# EAGLE schematic Teensy_v1.2 (EAGLE 7.7.0)
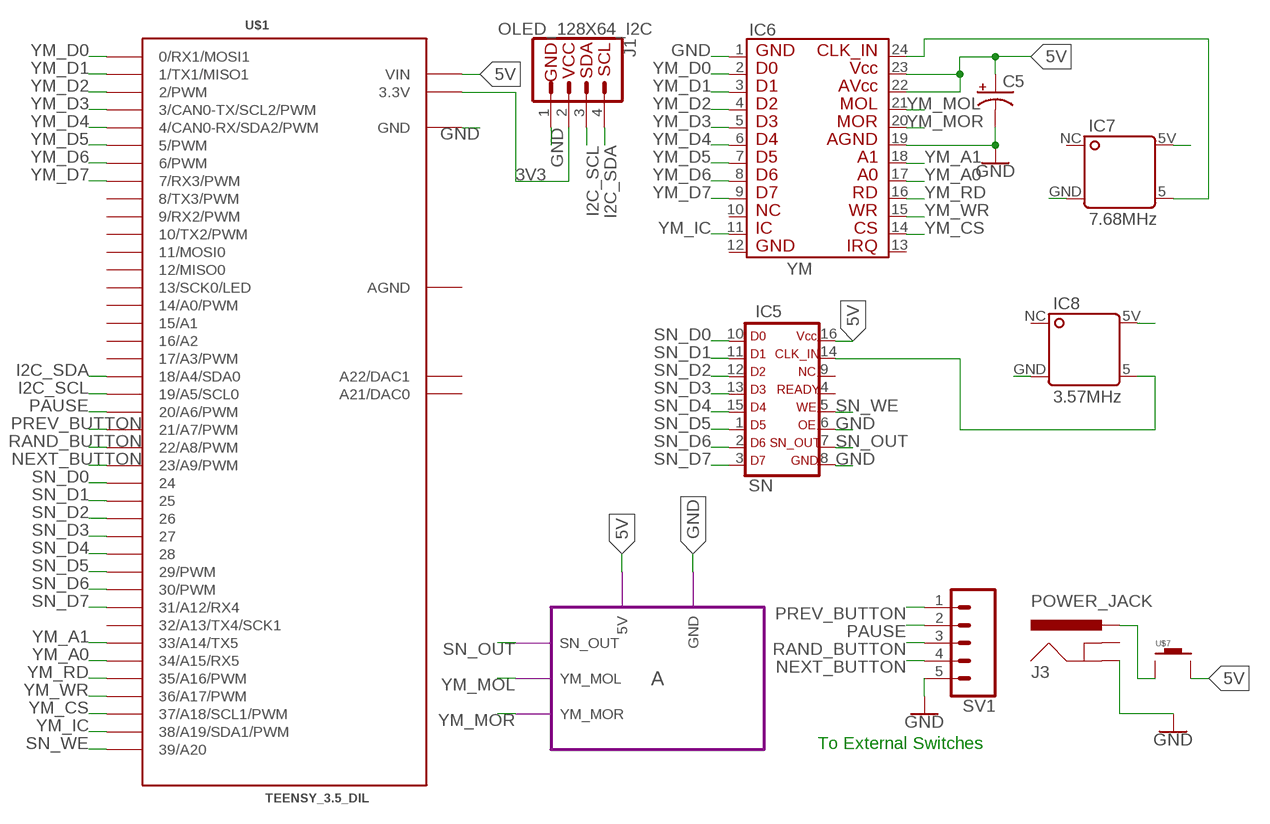
[diagram p0: schematic, sheet 1]

## Parts
C5  1000uF  CPOL-USE5-10.5  [E5-10,5]
IC5  SN  SN76489  [DIL16]
IC6  YM  YM2612-6  [DIL24-6]
IC7  7.68MHz  CLOCK_OSC  [DIL08-CLK]
IC8  3.57MHz  CLOCK_OSC  [DIL08-CLK]
J1  OLED_128X64_I2C  I2C_STANDARD  [1X04]
J3  POWER_JACK  [POWER_JACK_PTH]
SV1  CONN_05  [1X05]
U$1  TEENSY_3.5_DIL  [TEENSY_3.5_DIL]
U$7  GPTS20  [GPTS]

## Module instances
A = AMP

## Nets
3V3: J1.2 U$1.3.3V U$1.3.3V3(3.3V)
5V [power]: C5.+ IC5.16(V) IC6.22 IC6.23 IC7.5V IC8.5V U$1.VIN U$7.P$2 ; port A.5V
GND [power]: C5.- IC5.6(OE) IC5.8(GND) IC6.1 IC6.19 IC7.GND IC8.GND J1.1 J3.GND SV1.5 U$1.GND U$1.GND1(GND) ; port A.GND
I2C_SCL: J1.3 U$1.19/A5(19/A5/SCL0)
I2C_SDA: J1.4 U$1.18/A4(18/A4/SDA0)
N$1: IC6.24 IC7.5
N$2: J3.PWR U$7.P$1
N$11: IC5.14(CLK) IC8.5
NEXT_BUTTON: SV1.4 U$1.23/A9(23/A9/PWM)
PAUSE: SV1.2 U$1.20/A6(20/A6/PWM)
PREV_BUTTON: SV1.1 U$1.21/A7(21/A7/PWM)
RAND_BUTTON: SV1.3 U$1.22/A8(22/A8/PWM)
SN_D0: IC5.10(D0) U$1.24
SN_D1: IC5.11(D1) U$1.25
SN_D2: IC5.12(D2) U$1.26
SN_D3: IC5.13(D3) U$1.27
SN_D4: IC5.15(D4) U$1.28
SN_D5: IC5.1(D5) U$1.29(29/PWM)
SN_D6: IC5.2(D6) U$1.30(30/PWM)
SN_D7: IC5.3(D7) U$1.31/A12(31/A12/RX4)
SN_OUT: IC5.7(SN) ; port A.SN_OUT
SN_WE: IC5.5(WE) U$1.39/A20
YM_A0: IC6.17 U$1.34/A15(34/A15/RX5)
YM_A1: IC6.18 U$1.33/A14(33/A14/TX5)
YM_CS: IC6.14 U$1.37/A18(37/A18/SCL1/PWM)
YM_D0: IC6.2 U$1.0(0/RX1/MOSI1)
YM_D1: IC6.3 U$1.1(1/TX1/MISO1)
YM_D2: IC6.4 U$1.2(2/PWM)
YM_D3: IC6.5 U$1.3(3/CAN0-TX/SCL2/PWM)
YM_D4: IC6.6 U$1.4(4/CAN0-RX/SDA2/PWM)
YM_D5: IC6.7 U$1.5(5/PWM)
YM_D6: IC6.8 U$1.6(6/PWM)
YM_D7: IC6.9 U$1.7(7/RX3/PWM)
YM_IC: IC6.11 U$1.38/A19(38/A19/SDA1/PWM)
YM_MOL: IC6.21 ; port A.YM_MOL
YM_MOR: IC6.20 ; port A.YM_MOR
YM_RD: IC6.16 U$1.35/A16(35/A16/PWM)
YM_WR: IC6.15 U$1.36/A17(36/A17/PWM)
Unconnected: IC5.4(RDY) IC5.9(NC) IC6.10 IC6.12 IC6.13 IC7.NC IC8.NC J3.GNDBREAK U$1.8(8/TX3/PWM) U$1.9(9/RX2/PWM) U$1.10(10/TX2/PWM) U$1.11(11/MOSI0) U$1.12(12/MISO0) U$1.13(13/SCK0/LED) U$1.14/A0(14/A0/PWM) U$1.15/A1 U$1.16/A2 U$1.17/A3(17/A3/PWM) U$1.32/A13(32/A13/TX4/SCK1) U$1.A21(A21/DAC0) U$1.A22(A22/DAC1)

## Notes on the sheet
- To External Switches

## Power pins joined to a net without a drawn wire
AGND: U$1.AGND

## Library data of the parts
C5 = resistor:CPOL-US: POLARIZED CAPACITOR, American symbol; HEIGHT: 17.5
IC5 = Sega:SN76489: SN76489 Texas Instruments SN76489 PSG 16 DIP, Requires 3.57 MHz Clock 3 square wave tone generators. A wide range of frequencies. 16 different volume levels. 1 noise generator. 2 types (white noise and periodic). 3 different frequencies. 16 different volume levels. https://en.wikipedia.org/wiki/Texas_Instruments_SN76489; HEIGHT: 4.2
IC6 = Sega:YM2612: YM2612 Sound chip found in the Sega Genesis 24 DIP Package (OBN2); HEIGHT: 4.2
IC7 IC8 = Sega:CLOCK_OSC: CLOCK OSCILLATOR Dual In Line / Package; HEIGHT: 5.4
J1 = SparkFun-Connectors:I2C_STANDARD: SparkFun I2C Standard Pinout Header SparkFun has standardized on a pinout for all I2C based sensor breakouts. This pinout allows I2C boards to be plugged directly into the headers on Arduino Uno compatible boards, and to be daisy chained easily. Example SparkFun Products: SparkFun Atmospheric Sensor Breakout - BME280 <https://www.sparkfun.com/products/13676> SparkFun Altitude/Pressure Sensor Breakout - MPL3115A2 <https://www.sparkfun.com/products/11084> SparkFun TOF Range Finder Sensor - VL6180 <https://www.sparkfun.com/products/12785>
J3 = Sega:POWER_JACK: Power Jack Connector This is the standard 5.5mm barrel jack for power. The PTH is the most common, proven, reliable, footprint. The Slot footprint only works if the mill layer is transmitted to the PCB fab house so be warned. Here are the connectors we sell at SparkFun: DC Barrel Power Jack/Connector <https://www.sparkfun.com/products/119> (PRT-00119) DC Barrel Power Jack/Connector (SMD) <https://www.sparkfun.com/products/12748> (PRT-12748) DC Barrel Jack Adapter - Breadboard Compatible <https://www.sparkfun.com/products/10811> (PRT-10811) It is used on this SparkFun product (and many, many others): SparkFun RedBoard - Programmed with Arduino <https://www.sparkfun.com/products/12757> (DEV-12757) Also, if you need a mating power supply or connector, please check these out: Wall Adapter Power Supply - 9VDC 650mA <https://www.sparkfun.com/products/298> (TOL-00298) DC Barrel Jack Adapter - Male <https://www.sparkfun.com/products/10287> (PRT-10287); HEIGHT: 11
SV1 = SparkFun-Connectors:CONN_05: Multi connection point. Often used as Generic Header-pin footprint for 0.1 inch spaced/style header connections On any of the 0.1 inch spaced packages, you can populate with these: Break Away Headers - Straight <https://www.sparkfun.com/products/116> (PRT-00116) Break Away Male Headers - Right Angle <https://www.sparkfun.com/products/553> (PRT-00553) Female Headers <https://www.sparkfun.com/products/115> (PRT-00115) Break Away Headers - Machine Pin <https://www.sparkfun.com/products/117> (PRT-00117) Break Away Female Headers - Swiss Machine Pin <https://www.sparkfun.com/products/743> (PRT-00743) For SCREWTERMINALS and SPRING TERMINALS visit here: Screw Terimnals on SparkFun.com <https://www.sparkfun.com/search/results?term=Screw+Terminals> (5mm/3.5mm/2.54mm spacing) This device is also useful as a general connection point to wire up your design to another part of your project. Our various solder wires solder well into these plated through hole pads. Hook-Up Wire - Assortment (Stranded, 22 AWG) <https://www.sparkfun.com/products/11375> (PRT-11375) Hook-Up Wire - Assortment (Solid Core, 22 AWG) <https://www.sparkfun.com/products/11367> (PRT-11367) View the entire wire category on our website here <https://www.sparkfun.com/categories/141> Special notes: Molex polarized connector foot print use with SKU : PRT-08231 with associated crimp pins and housings. 1MM SMD Version SKU: PRT-10208
U$1 = Teensy_3_and_LC_Series_Boards_v1.4:TEENSY_3.5_DIL: DIL version of the Teensy 3.5; HEIGHT: 4.2
U$7 = Sega:GPTS20: PUSH BUTTON SPST GPTS203212B Digi-Key Part Number CW182-ND http://switches-connectors-custom.cwind.com/Asset/GPTS203212BR2.pdf; HEIGHT: 12

## Module AMP
Ports: SN_OUT(io) YM_MOL(io) YM_MOR(io) 5V(io) GND(io)
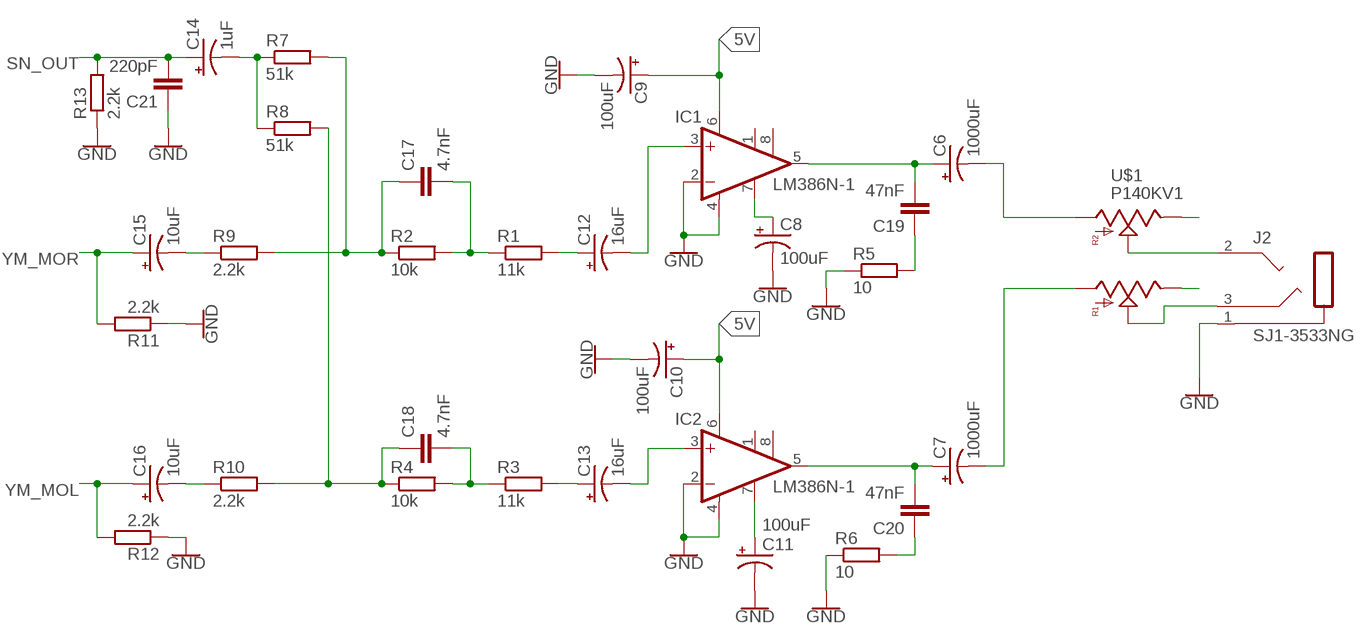
[diagram p1: schematic, module AMP, sheet 1]

### Parts
C6  1000uF  CPOL-USE5-10.5  [E5-10,5]
C7  1000uF  CPOL-USE5-10.5  [E5-10,5]
C8  100uF  CPOL-USE2-5  [E2-5]
C9  100uF  CPOL-USE2-5  [E2-5]
C10  100uF  CPOL-USE2-5  [E2-5]
C11  100uF  CPOL-USE2-5  [E2-5]
C12  16uF  CPOL-USE5-10.5  [E5-10,5]
C13  16uF  CPOL-USE5-10.5  [E5-10,5]
C14  1uF  CPOL-USE2-5  [E2-5]
C15  10uF  CPOL-USE2-5  [E2-5]
C16  10uF  CPOL-USE2-5  [E2-5]
C17  4.7nF  C-EU025-025X050  [C025-025X050]
C18  4.7nF  C-EU025-025X050  [C025-025X050]
C19  47nF  C-EU025-025X050  [C025-025X050]
C20  47nF  C-EU025-025X050  [C025-025X050]
C21  220pF  C-EU025-025X050  [C025-025X050]
IC1  LM386N-1  [DIL08]
IC2  LM386N-1  [DIL08]
J2  SJ1-3533NG  [SJ1-3533NG]
R1  11k  R-EU_0204/7  [0204/7]
R2  10k  R-EU_0204/7  [0204/7]
R3  11k  R-EU_0204/7  [0204/7]
R4  10k  R-EU_0204/7  [0204/7]
R5  10  R-EU_0204/7  [0204/7]
R6  10  R-EU_0204/7  [0204/7]
R7  51k  R-EU_0204/7  [0204/7]
R8  51k  R-EU_0204/7  [0204/7]
R9  2.2k  R-EU_0204/7  [0204/7]
R10  2.2k  R-EU_0204/7  [0204/7]
R11  2.2k  R-EU_0204/7  [0204/7]
R12  2.2k  R-EU_0204/7  [0204/7]
R13  2.2k  R-EU_0204/7  [0204/7]
U$1  P140KV1  [P14O]

### Nets
5V [power]: C9.+ C10.+ IC1.6(VS) IC2.6(VS)
GND [power]: C8.- C9.- C10.- C11.- C21.1 IC1.2(-IN) IC1.4(GND) IC2.2(-IN) IC2.4(GND) J2.1(S) R5.1 R6.1 R11.1 R12.1 R13.1 U$1.3 U$1.3'
N$1: C7.- U$1.1
N$2: C6.- U$1.1'
N$3: C6.+ C19.2 IC1.5(OUT)
N$4: C7.+ C20.2 IC2.5(OUT)
N$5: C8.+ IC1.7(BYPASS)
N$6: C11.+ IC2.7(BYPASS)
N$7: C12.- IC1.3(+IN)
N$8: C13.- IC2.3(+IN)
N$9: C12.+ R1.2
N$10: C13.+ R3.2
N$11: C19.1 R5.2
N$12: C20.1 R6.2
N$13: C18.1 R4.1 R8.2 R10.2
N$14: C17.1 R2.1 R7.2 R9.2
N$15: C14.- R7.1 R8.1
N$16: C15.- R9.1
N$17: C16.- R10.1
N$18: C17.2 R1.1 R2.2
N$19: C18.2 R3.1 R4.2
N$20: J2.2(T) U$1.2'
N$21: J2.3(R) U$1.2
SN_OUT: C14.+ C21.2 R13.2
YM_MOL: C16.+ R12.2
YM_MOR: C15.+ R11.2
Unconnected: IC1.1(GAIN) IC1.8(GAIN) IC2.1(GAIN) IC2.8(GAIN)

### Library data of the parts
C6 C7 = resistor:CPOL-US: POLARIZED CAPACITOR, American symbol; HEIGHT: 17.5
C8 C11 = resistor:CPOL-US: POLARIZED CAPACITOR, American symbol; HEIGHT: 12.5
C9 C10 = resistor:CPOL-US: POLARIZED CAPACITOR, American symbol; HEIGHT: 12.7
C12 C13 = resistor:CPOL-US: POLARIZED CAPACITOR, American symbol; HEIGHT: 26.5
C14 = resistor:CPOL-US: POLARIZED CAPACITOR, American symbol
C15 C16 = resistor:CPOL-US: POLARIZED CAPACITOR, American symbol; HEIGHT: 6.5
C17-C21 = resistor:C-EU: CAPACITOR, European symbol; HEIGHT: 3
IC1 IC2 = linear:LM386?-*: Low Voltage Audio Power Amplifier Source: http://cache.national.com/ds/LM/LM386.pdf; HEIGHT: 4.2
J2 = con-cuistack:SJ1-3533NG: RIGHT ANGLE STEREO JACK 3.5mm; HEIGHT: 12.3
R1 R2 R4-R13 = resistor:R-EU_: RESISTOR, European symbol; HEIGHT: 1.5
R3 = resistor:R-EU_: RESISTOR, European symbol
U$1 = Sega:P140KV1: DUAL GANG POT 10K OHM 1/20W PLASTIC LINEAR DigiKEy PN:987-1296-ND http://www.ttelectronics.com/sites/default/files/download-files/Datasheet_RotaryPanelPot_P140series.pdf; HEIGHT: 16.7

## Net classes
0 default: width 0.508 mm
1 power: width 1.016 mm